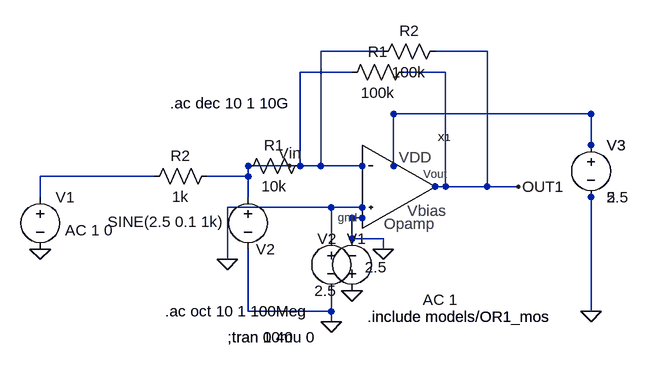
[diagram p0: schematic amp2_tb.asc]
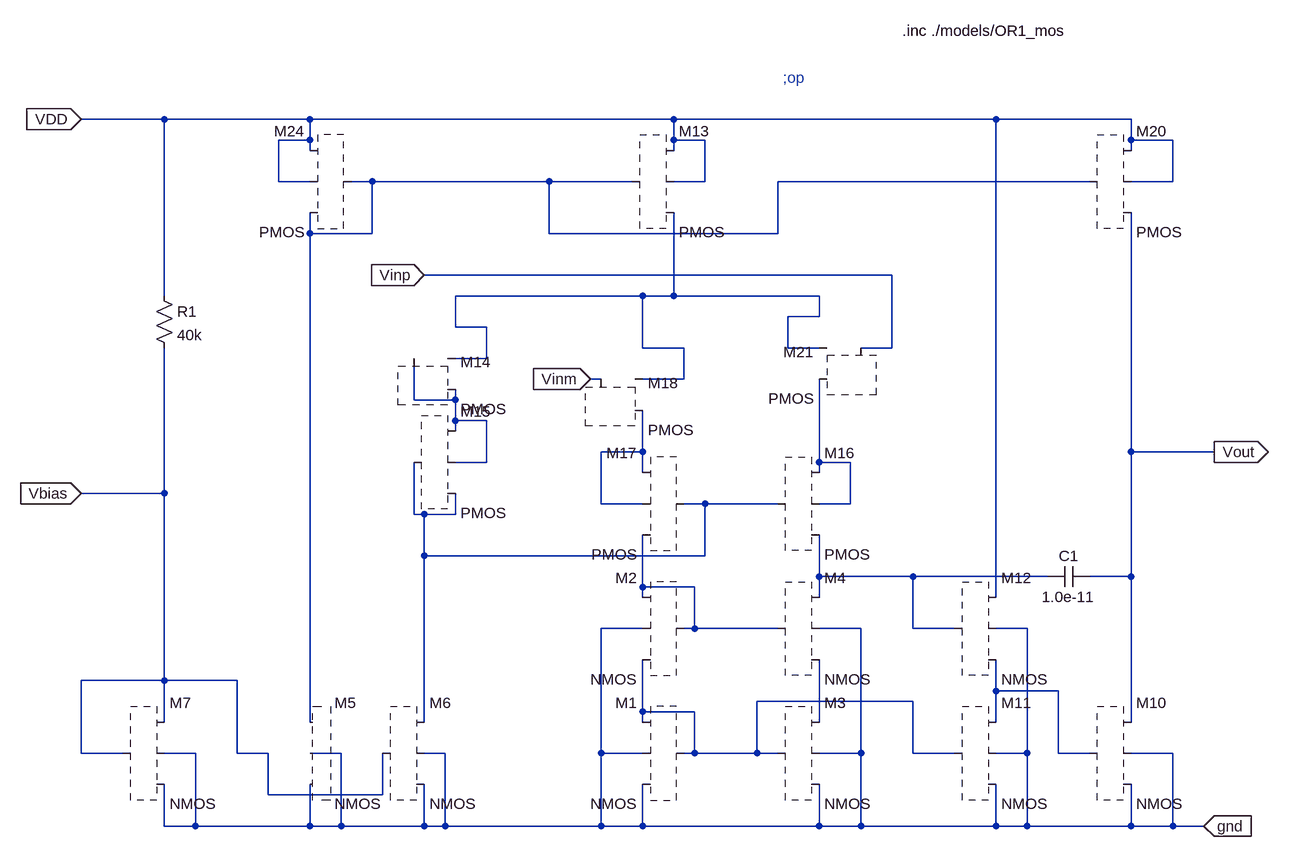
[diagram p1: sub-circuit opamp3ureiauto.asc]
amp2_tb.asc, the LTspice schematic file:
Version 4
SHEET 1 880 680
<<<<<<< HEAD
WIRE 48 -32 -32 -32
WIRE 192 -32 128 -32
WIRE 416 32 112 32
WIRE 416 80 416 32
WIRE -48 112 -112 112
WIRE -32 112 -32 -32
WIRE -32 112 -48 112
WIRE 64 112 -32 112
WIRE 112 112 112 32
WIRE -256 128 -432 128
WIRE -112 128 -112 112
WIRE -112 128 -176 128
WIRE 192 144 192 -32
WIRE 192 144 176 144
WIRE 304 144 192 144
WIRE -432 160 -432 128
WIRE 64 176 -144 176
WIRE 64 192 48 192
WIRE 48 224 48 192
WIRE -144 256 -144 176
WIRE 416 336 416 160
FLAG 416 336 0
FLAG 304 144 OUT1
FLAG 48 304 0
FLAG -144 256 0
FLAG -432 240 0
FLAG -48 112 Vin
DATAFLAG 256 32 ""
SYMBOL voltage 416 64 R0
SYMATTR InstName V3
SYMATTR Value 2.5
SYMBOL Opamp3ureiauto 144 144 R0
SYMATTR InstName X1
SYMBOL voltage -432 144 R0
WINDOW 3 35 44 Left 2
WINDOW 123 38 67 Left 2
WINDOW 39 0 0 Left 0
SYMATTR Value ""
SYMATTR Value2 AC 1 0
SYMATTR InstName V1
SYMBOL voltage 48 320 R180
WINDOW 0 24 96 Left 2
WINDOW 3 24 16 Left 2
WINDOW 123 0 0 Left 0
WINDOW 39 0 0 Left 0
SYMATTR InstName V2
SYMATTR Value 2.5
SYMBOL res 144 -48 R90
WINDOW 0 0 56 VBottom 2
WINDOW 3 32 56 VTop 2
SYMATTR InstName R1
SYMATTR Value 100k
SYMBOL res -160 112 R90
WINDOW 0 0 56 VBottom 2
WINDOW 3 32 56 VTop 2
SYMATTR InstName R2
SYMATTR Value 1k
TEXT 72 344 Left 2 !.include models/OR1_mos
TEXT -144 376 Left 2 !;tran 0 40u 0
TEXT -240 336 Left 2 !.ac oct 10 1 100Meg
=======
WIRE 96 -64 0 -64
WIRE 256 -64 176 -64
WIRE 416 32 112 32
WIRE 416 80 416 32
WIRE 0 112 0 -64
WIRE 0 112 -32 112
WIRE 64 112 0 112
WIRE 112 112 112 32
WIRE 256 144 256 -64
WIRE 256 144 176 144
WIRE 304 144 256 144
WIRE -112 160 -112 112
WIRE 64 176 16 176
WIRE 64 192 48 192
WIRE 16 224 16 176
WIRE 48 224 48 192
WIRE 96 224 48 224
WIRE 96 240 96 224
WIRE -112 336 -112 240
WIRE 16 336 16 304
WIRE 16 336 -112 336
WIRE 416 336 416 160
WIRE 16 352 16 336
FLAG 16 352 0
FLAG 416 336 0
FLAG 304 144 OUT1
FLAG 96 240 0
SYMBOL voltage -112 144 R0
WINDOW 3 -216 54 Left 2
WINDOW 123 269 174 Left 2
WINDOW 39 0 0 Left 0
WINDOW 0 12 96 Left 2
SYMATTR Value SINE(2.5 0.1 1k)
SYMATTR Value2 AC 1
SYMATTR InstName V2
SYMBOL res -16 96 R90
WINDOW 0 0 56 VBottom 2
WINDOW 3 32 56 VTop 2
SYMATTR InstName R1
SYMATTR Value 10k
SYMBOL res 192 -80 R90
WINDOW 0 0 56 VBottom 2
WINDOW 3 32 56 VTop 2
SYMATTR InstName R2
SYMATTR Value 100k
SYMBOL voltage 416 64 R0
SYMATTR InstName V3
SYMATTR Value 5
SYMBOL Opamp3ureiauto 144 144 R0
SYMATTR InstName X1
SYMBOL voltage 16 208 R0
WINDOW 3 52 60 Left 2
WINDOW 123 24 124 Left 2
WINDOW 39 0 0 Left 0
SYMATTR Value 2.5
SYMATTR InstName V1
TEXT 72 344 Left 2 !.include models/OR1_mos
TEXT -144 376 Left 2 !;tran 10m
TEXT -232 16 Left 2 !.ac dec 10 1 10G
>>>>>>> 8f260bfd9339b3c434082bdab42e9bc5b93cfb68

opamp3ureiauto.asc, the sub-circuit schematic file:
Version 4
SHEET 1 2772 1432
WIRE 816 48 688 48
WIRE 1040 48 816 48
WIRE 1600 48 1040 48
WIRE 2096 48 1600 48
WIRE 2304 48 2096 48
WIRE 1040 80 1040 48
WIRE 1040 80 992 80
WIRE 1600 80 1600 48
WIRE 1648 80 1600 80
WIRE 2304 80 2304 48
WIRE 2368 80 2304 80
WIRE 1040 96 1040 80
WIRE 1600 96 1600 80
WIRE 2304 96 2304 80
WIRE 992 144 992 80
WIRE 1040 144 992 144
WIRE 1136 144 1104 144
WIRE 1408 144 1136 144
WIRE 1536 144 1408 144
WIRE 1648 144 1648 80
WIRE 1648 144 1600 144
WIRE 2240 144 1760 144
WIRE 2368 144 2368 80
WIRE 2368 144 2304 144
WIRE 1040 224 1040 192
WIRE 1136 224 1136 144
WIRE 1136 224 1040 224
WIRE 1408 224 1408 144
WIRE 1760 224 1760 144
WIRE 1760 224 1408 224
WIRE 1936 288 1216 288
WIRE 816 320 816 48
WIRE 1552 320 1264 320
WIRE 1600 320 1600 192
WIRE 1600 320 1552 320
WIRE 1824 320 1600 320
WIRE 1824 352 1824 320
WIRE 1824 352 1776 352
WIRE 1264 368 1264 320
WIRE 1312 368 1264 368
WIRE 1552 400 1552 320
WIRE 1616 400 1552 400
WIRE 1776 400 1776 352
WIRE 1824 400 1776 400
WIRE 1936 400 1936 288
WIRE 1936 400 1888 400
WIRE 1312 416 1312 368
WIRE 1312 416 1264 416
WIRE 1488 448 1472 448
WIRE 1616 448 1616 400
WIRE 1616 448 1552 448
WIRE 1200 480 1200 416
WIRE 1264 480 1264 464
WIRE 1264 480 1200 480
WIRE 1264 512 1264 480
WIRE 1312 512 1264 512
WIRE 1264 528 1264 512
WIRE 1552 560 1552 496
WIRE 1552 560 1488 560
WIRE 2304 560 2304 192
WIRE 2432 560 2304 560
WIRE 1312 576 1312 512
WIRE 1312 576 1264 576
WIRE 1824 576 1824 448
WIRE 1872 576 1824 576
WIRE 1552 592 1552 560
WIRE 1824 592 1824 576
WIRE 816 624 816 400
WIRE 816 624 688 624
WIRE 1488 640 1488 560
WIRE 1552 640 1488 640
WIRE 1648 640 1616 640
WIRE 1760 640 1648 640
WIRE 1872 640 1872 576
WIRE 1872 640 1824 640
WIRE 1200 656 1200 576
WIRE 1216 656 1200 656
WIRE 1264 656 1264 624
WIRE 1264 656 1216 656
WIRE 1216 720 1216 656
WIRE 1648 720 1648 640
WIRE 1648 720 1216 720
WIRE 1824 752 1824 688
WIRE 1968 752 1824 752
WIRE 2176 752 1968 752
WIRE 2304 752 2304 560
WIRE 2304 752 2240 752
WIRE 1552 768 1552 688
WIRE 1632 768 1552 768
WIRE 1552 784 1552 768
WIRE 1824 784 1824 752
WIRE 2096 784 2096 48
WIRE 1552 832 1488 832
WIRE 1632 832 1632 768
WIRE 1632 832 1616 832
WIRE 1760 832 1632 832
WIRE 1888 832 1824 832
WIRE 1968 832 1968 752
WIRE 2032 832 1968 832
WIRE 2144 832 2096 832
WIRE 816 912 816 624
WIRE 816 912 688 912
WIRE 928 912 816 912
WIRE 2096 928 2096 880
WIRE 2192 928 2096 928
WIRE 1968 944 1728 944
WIRE 1552 960 1552 880
WIRE 1632 960 1552 960
WIRE 816 976 816 912
WIRE 1040 976 1040 224
WIRE 1216 976 1216 720
WIRE 1552 976 1552 960
WIRE 1824 976 1824 880
WIRE 2096 976 2096 928
WIRE 2304 976 2304 752
WIRE 688 1024 688 912
WIRE 752 1024 688 1024
WIRE 864 1024 816 1024
WIRE 928 1024 928 912
WIRE 976 1024 928 1024
WIRE 1088 1024 1040 1024
WIRE 1248 1024 1216 1024
WIRE 1488 1024 1488 832
WIRE 1552 1024 1488 1024
WIRE 1632 1024 1632 960
WIRE 1632 1024 1616 1024
WIRE 1728 1024 1728 944
WIRE 1728 1024 1632 1024
WIRE 1760 1024 1728 1024
WIRE 1888 1024 1888 832
WIRE 1888 1024 1824 1024
WIRE 1968 1024 1968 944
WIRE 2032 1024 1968 1024
WIRE 2144 1024 2144 832
WIRE 2144 1024 2096 1024
WIRE 2192 1024 2192 928
WIRE 2240 1024 2192 1024
WIRE 2368 1024 2304 1024
WIRE 976 1088 976 1024
WIRE 1152 1088 1152 1024
WIRE 1152 1088 976 1088
WIRE 816 1136 816 1072
WIRE 864 1136 864 1024
WIRE 864 1136 816 1136
WIRE 1040 1136 1040 1072
WIRE 1040 1136 864 1136
WIRE 1088 1136 1088 1024
WIRE 1088 1136 1040 1136
WIRE 1216 1136 1216 1072
WIRE 1216 1136 1088 1136
WIRE 1248 1136 1248 1024
WIRE 1248 1136 1216 1136
WIRE 1488 1136 1488 1024
WIRE 1488 1136 1248 1136
WIRE 1552 1136 1552 1072
WIRE 1552 1136 1488 1136
WIRE 1824 1136 1824 1072
WIRE 1824 1136 1552 1136
WIRE 1888 1136 1888 1024
WIRE 1888 1136 1824 1136
WIRE 2096 1136 2096 1072
WIRE 2096 1136 1888 1136
WIRE 2144 1136 2144 1024
WIRE 2144 1136 2096 1136
WIRE 2304 1136 2304 1072
WIRE 2304 1136 2144 1136
WIRE 2368 1136 2368 1024
WIRE 2368 1136 2304 1136
WIRE 2416 1136 2368 1136
FLAG 1472 448 Vinm
IOPIN 1472 448 In
FLAG 1216 288 Vinp
IOPIN 1216 288 In
FLAG 688 48 VDD
IOPIN 688 48 In
FLAG 688 624 Vbias
IOPIN 688 624 In
FLAG 2432 560 Vout
IOPIN 2432 560 Out
FLAG 2416 1136 gnd
IOPIN 2416 1136 In
SYMBOL OR1LIB\\NMOS 1616 1024 M0
SYMATTR InstName M1
SYMATTR Value2 l=1u w=16u ad=3.5e-10 as=3.5e-10 pd=64e-6 ps=64e-6
SYMBOL OR1LIB\\NMOS 1616 832 M0
SYMATTR InstName M2
SYMATTR Value2 l=1u w=16u ad=3.5e-10 as=3.5e-10 pd=64e-6 ps=64e-6
SYMBOL OR1LIB\\NMOS 1760 1024 R0
SYMATTR InstName M3
SYMATTR Value2 l=1u w=16u ad=3.5e-10 as=3.5e-10 pd=64e-6 ps=64e-6
SYMBOL OR1LIB\\NMOS 1760 832 R0
SYMATTR InstName M4
SYMATTR Value2 l=1u w=16u ad=3.5e-10 as=3.5e-10 pd=64e-6 ps=64e-6
SYMBOL OR1LIB\\NMOS 976 1024 R0
SYMATTR InstName M5
SYMATTR Value2 l=1u w=34u ad=7e-10 as=7e-10 pd=114e-6 ps=114e-6
SYMBOL OR1LIB\\NMOS 1152 1024 R0
SYMATTR InstName M6
SYMATTR Value2 l=1u w=16u ad=3.5e-10 as=3.5e-10 pd=64e-6 ps=64e-6
SYMBOL OR1LIB\\NMOS 2240 1024 R0
SYMATTR InstName M10
SYMATTR Value2 l=1u w=100u ad=2.1e-9 as=2.1e-9 pd=314e-6 ps=314e-6
SYMBOL OR1LIB\\NMOS 2032 1024 R0
SYMATTR InstName M11
SYMATTR Value2 l=1u w=16u ad=3.5e-10 as=3.5e-10 pd=64e-6 ps=64e-6
SYMBOL OR1LIB\\NMOS 2032 832 R0
SYMATTR InstName M12
SYMATTR Value2 l=1u w=16u ad=3.5e-10 as=3.5e-10 pd=64e-6 ps=64e-6
SYMBOL OR1LIB\\PMOS 1536 144 R0
SYMATTR InstName M13
SYMATTR Value2 l=1u w=50u ad=1.05e-9 as=1.05e-9 pd=164e-6 ps=164e-6
SYMBOL OR1LIB\\PMOS 1200 416 R0
SYMATTR InstName M14
SYMATTR Value2 l=1u w=38u ad=5.25e-10 as=5.25e-10 pd=89e-6 ps=89e-6
SYMBOL OR1LIB\\PMOS 1200 576 R0
SYMATTR InstName M15
SYMATTR Value2 l=1u w=38u ad=5.25e-10 as=5.25e-10 pd=89e-6 ps=89e-6
SYMBOL OR1LIB\\PMOS 1760 640 R0
SYMATTR InstName M16
SYMATTR Value2 l=1u w=19u ad=5.25e-10 as=5.25e-10 pd=89e-6 ps=89e-6
SYMBOL OR1LIB\\PMOS 1616 640 M0
SYMATTR InstName M17
SYMATTR Value2 l=1u w=19u ad=5.25e-10 as=5.25e-10 pd=89e-6 ps=89e-6
SYMBOL OR1LIB\\PMOS 1488 448 R0
SYMATTR InstName M18
SYMATTR Value2 l=1u w=25u ad=5.25e-10 as=5.25e-10 pd=89e-6 ps=89e-6
SYMBOL OR1LIB\\PMOS 2240 144 R0
SYMATTR InstName M20
SYMATTR Value2 l=1u w=50u ad=1.05e-9 as=1.05e-9 pd=164e-6 ps=164e-6
SYMBOL OR1LIB\\PMOS 1888 400 M0
SYMATTR InstName M21
SYMATTR Value2 l=1u w=25u ad=5.25e-10 as=5.25e-10 pd=89e-6 ps=89e-6
SYMBOL OR1LIB\\PMOS 1104 144 M0
SYMATTR InstName M24
SYMATTR Value2 l=1u w=50u ad=1.05e-9 as=1.05e-9 pd=164e-6 ps=164e-6
SYMBOL OR1LIB\\NMOS 752 1024 R0
SYMATTR InstName M7
SYMATTR Value2 l=1u w=34u ad=7e-10 as=7e-10 pd=114e-6 ps=114e-6
SYMBOL res 800 304 R0
SYMATTR InstName R1
SYMATTR Value 40k
SYMBOL cap 2240 736 R90
WINDOW 0 0 32 VBottom 2
WINDOW 3 32 32 VTop 2
SYMATTR InstName C1
SYMATTR Value 1.0e-11
TEXT 1768 -16 Left 2 ;;op
TEXT 1952 -88 Left 2 !.inc ./models/OR1_mos

The netlist it stands for:
* amp2_tb.asc
V3 N001 0 2.5
XX1 Vin 0 OUT1 N001 P001 0 opamp3ureiauto
V1 N002 0 AC 1 0
V2 0 0 2.5
R1 OUT1 Vin 100k
R2 Vin N002 1k
V2 Vin 0 SINE(2.5 0.1 1k) AC 1
R1 Vin Vin 10k
R2 OUT1 Vin 100k
V3 N001 0 5
XX1 Vin 0 OUT1 N001 P001 0 opamp3ureiauto
V1 0 0 2.5

* block symbol definitions
.subckt opamp3ureiauto Vinm Vinp Vout VDD Vbias gnd
* M1: l=1u w=16u ad=3.5e-10 as=3.5e-10 pd=64e-6 ps=64e-6 (symbol OR1LIB\NMOS not available, pin order unknown); nets seen at it: gnd, N010
* M2: l=1u w=16u ad=3.5e-10 as=3.5e-10 pd=64e-6 ps=64e-6 (symbol OR1LIB\NMOS not available, pin order unknown); nets seen at it: gnd, N008, N010
* M3: l=1u w=16u ad=3.5e-10 as=3.5e-10 pd=64e-6 ps=64e-6 (symbol OR1LIB\NMOS not available, pin order unknown); nets seen at it: gnd, N010, N011
* M4: l=1u w=16u ad=3.5e-10 as=3.5e-10 pd=64e-6 ps=64e-6 (symbol OR1LIB\NMOS not available, pin order unknown); nets seen at it: gnd, N007, N008, N011
* M5: l=1u w=34u ad=7e-10 as=7e-10 pd=114e-6 ps=114e-6 (symbol OR1LIB\NMOS not available, pin order unknown); nets seen at it: gnd, N001
* M6: l=1u w=16u ad=3.5e-10 as=3.5e-10 pd=64e-6 ps=64e-6 (symbol OR1LIB\NMOS not available, pin order unknown); nets seen at it: gnd, N006, Vbias
* M10: l=1u w=100u ad=2.1e-9 as=2.1e-9 pd=314e-6 ps=314e-6 (symbol OR1LIB\NMOS not available, pin order unknown); nets seen at it: gnd, N009, Vout
* M11: l=1u w=16u ad=3.5e-10 as=3.5e-10 pd=64e-6 ps=64e-6 (symbol OR1LIB\NMOS not available, pin order unknown); nets seen at it: gnd, N009, N010
* M12: l=1u w=16u ad=3.5e-10 as=3.5e-10 pd=64e-6 ps=64e-6 (symbol OR1LIB\NMOS not available, pin order unknown); nets seen at it: gnd, N007, N009, VDD
* M13: l=1u w=50u ad=1.05e-9 as=1.05e-9 pd=164e-6 ps=164e-6 (symbol OR1LIB\PMOS not available, pin order unknown); nets seen at it: N001, N002, VDD
* M14: l=1u w=38u ad=5.25e-10 as=5.25e-10 pd=89e-6 ps=89e-6 (symbol OR1LIB\PMOS not available, pin order unknown); nets seen at it: N002, N003
* M15: l=1u w=38u ad=5.25e-10 as=5.25e-10 pd=89e-6 ps=89e-6 (symbol OR1LIB\PMOS not available, pin order unknown); nets seen at it: N003, N006
* M16: l=1u w=19u ad=5.25e-10 as=5.25e-10 pd=89e-6 ps=89e-6 (symbol OR1LIB\PMOS not available, pin order unknown); nets seen at it: N005, N006, N007
* M17: l=1u w=19u ad=5.25e-10 as=5.25e-10 pd=89e-6 ps=89e-6 (symbol OR1LIB\PMOS not available, pin order unknown); nets seen at it: N004, N006, N008
* M18: l=1u w=25u ad=5.25e-10 as=5.25e-10 pd=89e-6 ps=89e-6 (symbol OR1LIB\PMOS not available, pin order unknown); nets seen at it: N002, N004, Vinm
* M20: l=1u w=50u ad=1.05e-9 as=1.05e-9 pd=164e-6 ps=164e-6 (symbol OR1LIB\PMOS not available, pin order unknown); nets seen at it: N001, VDD, Vout
* M21: l=1u w=25u ad=5.25e-10 as=5.25e-10 pd=89e-6 ps=89e-6 (symbol OR1LIB\PMOS not available, pin order unknown); nets seen at it: N002, N005, Vinp
* M24: l=1u w=50u ad=1.05e-9 as=1.05e-9 pd=164e-6 ps=164e-6 (symbol OR1LIB\PMOS not available, pin order unknown); nets seen at it: N001, VDD
* M7: l=1u w=34u ad=7e-10 as=7e-10 pd=114e-6 ps=114e-6 (symbol OR1LIB\NMOS not available, pin order unknown); nets seen at it: gnd, Vbias
R1 VDD Vbias 40k
C1 Vout N007 1.0e-11
* ;op
.inc ./models/OR1_mos
.ends opamp3ureiauto

.include models/OR1_mos
;tran 0 40u 0
.ac oct 10 1 100Meg
.include models/OR1_mos
;tran 10m
.ac dec 10 1 10G
.backanno
.end